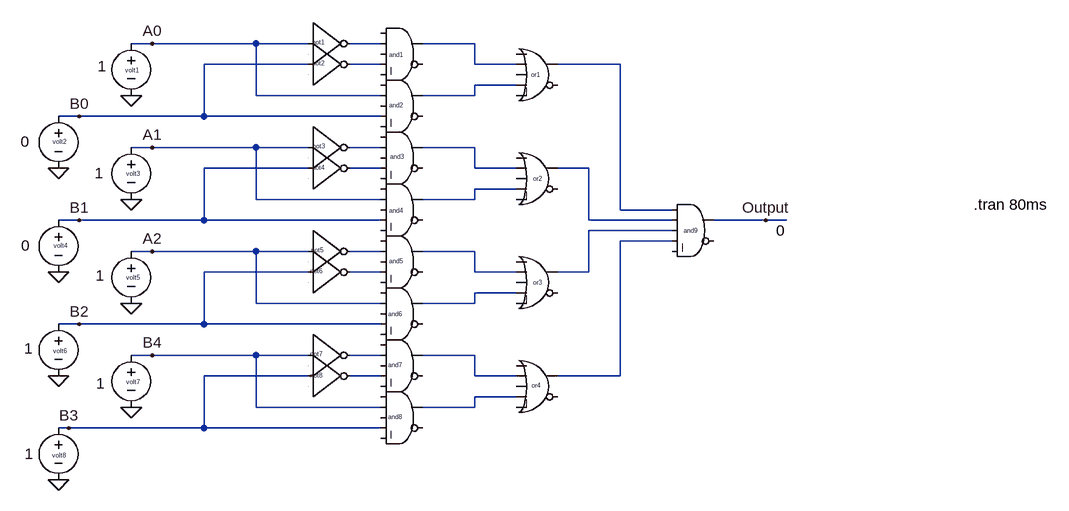
[diagram p0: schematic pregunta1.asc]
pregunta1.asc, the LTspice schematic file:
Version 4
SHEET 1 1240 704
WIRE -144 16 -176 16
WIRE 16 16 -144 16
WIRE 96 16 16 16
WIRE 208 16 160 16
WIRE 352 16 272 16
WIRE 96 48 -64 48
WIRE 208 48 160 48
WIRE 352 48 352 16
WIRE 416 48 352 48
WIRE 576 48 480 48
WIRE 416 80 352 80
WIRE 16 96 16 16
WIRE 208 96 16 96
WIRE 352 96 352 80
WIRE 352 96 272 96
WIRE -256 128 -288 128
WIRE -64 128 -64 48
WIRE -64 128 -256 128
WIRE 208 128 -64 128
WIRE -144 176 -176 176
WIRE 16 176 -144 176
WIRE 96 176 16 176
WIRE 208 176 160 176
WIRE 352 176 272 176
WIRE 96 208 -64 208
WIRE 208 208 160 208
WIRE 352 208 352 176
WIRE 416 208 352 208
WIRE 528 208 480 208
WIRE 416 240 352 240
WIRE 16 256 16 176
WIRE 208 256 16 256
WIRE 352 256 352 240
WIRE 352 256 272 256
WIRE 576 272 576 48
WIRE 656 272 576 272
WIRE -256 288 -288 288
WIRE -64 288 -64 208
WIRE -64 288 -256 288
WIRE 208 288 -64 288
WIRE 528 288 528 208
WIRE 656 288 528 288
WIRE 800 288 720 288
WIRE 832 288 800 288
WIRE 656 304 528 304
WIRE 656 320 576 320
WIRE -144 336 -176 336
WIRE 16 336 -144 336
WIRE 96 336 16 336
WIRE 208 336 160 336
WIRE 352 336 272 336
WIRE 96 368 -64 368
WIRE 208 368 160 368
WIRE 352 368 352 336
WIRE 416 368 352 368
WIRE 528 368 528 304
WIRE 528 368 480 368
WIRE 416 400 352 400
WIRE 16 416 16 336
WIRE 208 416 16 416
WIRE 352 416 352 400
WIRE 352 416 272 416
WIRE -256 448 -288 448
WIRE -64 448 -64 368
WIRE -64 448 -256 448
WIRE 208 448 -64 448
WIRE -144 496 -176 496
WIRE 16 496 -144 496
WIRE 96 496 16 496
WIRE 208 496 160 496
WIRE 352 496 272 496
WIRE 96 528 -64 528
WIRE 208 528 160 528
WIRE 352 528 352 496
WIRE 416 528 352 528
WIRE 576 528 576 320
WIRE 576 528 480 528
WIRE 416 560 352 560
WIRE 16 576 16 496
WIRE 208 576 16 576
WIRE 352 576 352 560
WIRE 352 576 272 576
WIRE -272 608 -288 608
WIRE -64 608 -64 528
WIRE -64 608 -272 608
WIRE 208 608 -64 608
FLAG -176 96 0
FLAG -288 208 0
FLAG -176 256 0
FLAG -288 368 0
FLAG -176 416 0
FLAG -288 528 0
FLAG -176 576 0
FLAG -288 688 0
FLAG 800 288 Output
FLAG -144 16 A0
FLAG -256 128 B0
FLAG -144 176 A1
FLAG -144 336 A2
FLAG -256 288 B1
FLAG -256 448 B2
FLAG -272 608 B3
FLAG -144 496 B4
SYMBOL Digital/and 240 -32 R0
WINDOW 0 -19 65 Left 0
SYMATTR InstName and1
SYMBOL Digital/and 240 48 R0
WINDOW 0 -19 63 Left 0
SYMATTR InstName and2
SYMBOL Digital/and 240 128 R0
WINDOW 0 -18 62 Left 0
SYMATTR InstName and3
SYMBOL Digital/and 240 208 R0
WINDOW 0 -19 65 Left 0
SYMATTR InstName and4
SYMBOL Digital/and 240 288 R0
WINDOW 0 -19 63 Left 0
SYMATTR InstName and5
SYMBOL Digital/and 240 368 R0
WINDOW 0 -21 64 Left 0
SYMATTR InstName and6
SYMBOL Digital/and 240 448 R0
WINDOW 0 -21 63 Left 0
SYMATTR InstName and7
SYMBOL Digital/and 240 528 R0
WINDOW 0 -21 63 Left 0
SYMATTR InstName and8
SYMBOL Digital/inv 96 -48 R0
WINDOW 0 6 62 Left 0
SYMATTR InstName not1
SYMBOL Digital/inv 96 -16 R0
WINDOW 0 6 62 Left 0
SYMATTR InstName not2
SYMBOL Digital/inv 96 112 R0
WINDOW 0 7 62 Left 0
SYMATTR InstName not3
SYMBOL Digital/inv 96 144 R0
WINDOW 0 6 63 Left 0
SYMATTR InstName not4
SYMBOL Digital/inv 96 272 R0
WINDOW 0 5 62 Left 0
SYMATTR InstName not5
SYMBOL Digital/inv 96 304 R0
WINDOW 0 3 62 Left 0
SYMATTR InstName not6
SYMBOL Digital/inv 96 432 R0
WINDOW 0 3 62 Left 0
SYMATTR InstName not7
SYMBOL Digital/inv 96 464 R0
WINDOW 0 3 63 Left 0
SYMATTR InstName not8
SYMBOL Digital/or 448 0 R0
WINDOW 0 -9 64 Left 0
SYMATTR InstName or1
SYMBOL Digital/or 448 160 R0
WINDOW 0 -6 64 Left 0
SYMATTR InstName or2
SYMBOL Digital/or 448 320 R0
WINDOW 0 -6 64 Left 0
SYMATTR InstName or3
SYMBOL Digital/or 448 480 R0
WINDOW 0 -8 62 Left 0
SYMATTR InstName or4
SYMBOL Digital/and 688 240 R0
WINDOW 0 -14 64 Left 0
SYMATTR InstName and9
SYMBOL voltage -176 0 R0
WINDOW 0 -9 57 Left 0
WINDOW 3 -52 51 Left 2
SYMATTR InstName volt1
SYMATTR Value 1
SYMBOL voltage -288 112 R0
WINDOW 0 -9 55 Left 0
WINDOW 3 -58 55 Left 2
SYMATTR InstName volt2
SYMATTR Value 0
SYMBOL voltage -176 160 R0
WINDOW 0 -8 56 Left 0
WINDOW 3 -56 55 Left 2
SYMATTR InstName volt3
SYMATTR Value 1
SYMBOL voltage -288 272 R0
WINDOW 0 -7 55 Left 0
WINDOW 3 -57 55 Left 2
SYMATTR InstName volt4
SYMATTR Value 0
SYMBOL voltage -176 320 R0
WINDOW 0 -8 56 Left 0
WINDOW 3 -55 53 Left 2
SYMATTR InstName volt5
SYMATTR Value 1
SYMBOL voltage -288 432 R0
WINDOW 0 -8 57 Left 0
WINDOW 3 -53 53 Left 2
SYMATTR InstName volt6
SYMATTR Value 1
SYMBOL voltage -176 480 R0
WINDOW 0 -8 57 Left 0
WINDOW 3 -54 59 Left 2
SYMATTR InstName volt7
SYMATTR Value 1
SYMBOL voltage -288 592 R0
WINDOW 0 -10 58 Left 0
WINDOW 3 -52 56 Left 2
SYMATTR InstName volt8
SYMATTR Value 1
TEXT 1120 264 Left 2 !.tran 80ms
TEXT 816 304 Left 2 !0

The netlist it stands for:
* pregunta1.asc
and1 0 N001 0 N003 0 0 N002 0 AND
and2 0 A0 0 B0 0 0 N005 0 AND
and3 0 N006 0 N008 0 0 N007 0 AND
and4 0 A1 0 B1 0 0 N010 0 AND
and5 0 N013 0 N015 0 0 N014 0 AND
and6 0 A2 0 B2 0 0 N016 0 AND
and7 0 N017 0 N019 0 0 N018 0 AND
and8 0 B4 0 B3 0 0 N020 0 AND
A§not1 A0 0 0 0 0 N001 0 0 BUF
A§not2 B0 0 0 0 0 N003 0 0 BUF
A§not3 A1 0 0 0 0 N006 0 0 BUF
A§not4 B1 0 0 0 0 N008 0 0 BUF
A§not5 A2 0 0 0 0 N013 0 0 BUF
A§not6 B2 0 0 0 0 N015 0 0 BUF
A§not7 B4 0 0 0 0 N017 0 0 BUF
A§not8 B3 0 0 0 0 N019 0 0 BUF
A§or1 0 N002 0 N005 0 0 N004 0 OR
A§or2 0 N007 0 N010 0 0 N009 0 OR
A§or3 0 N014 0 N016 0 0 N011 0 OR
A§or4 0 N018 0 N020 0 0 N012 0 OR
and9 N004 N009 N011 N012 0 0 Output 0 AND
volt1 A0 0 1
volt2 B0 0 0
volt3 A1 0 1
volt4 B1 0 0
volt5 A2 0 1
volt6 B2 0 1
volt7 B4 0 1
volt8 B3 0 1
.tran 80ms
0
.backanno
.end